# EAGLE schematic PiezoAmpHVDCv3 (EAGLE 6.6.0)
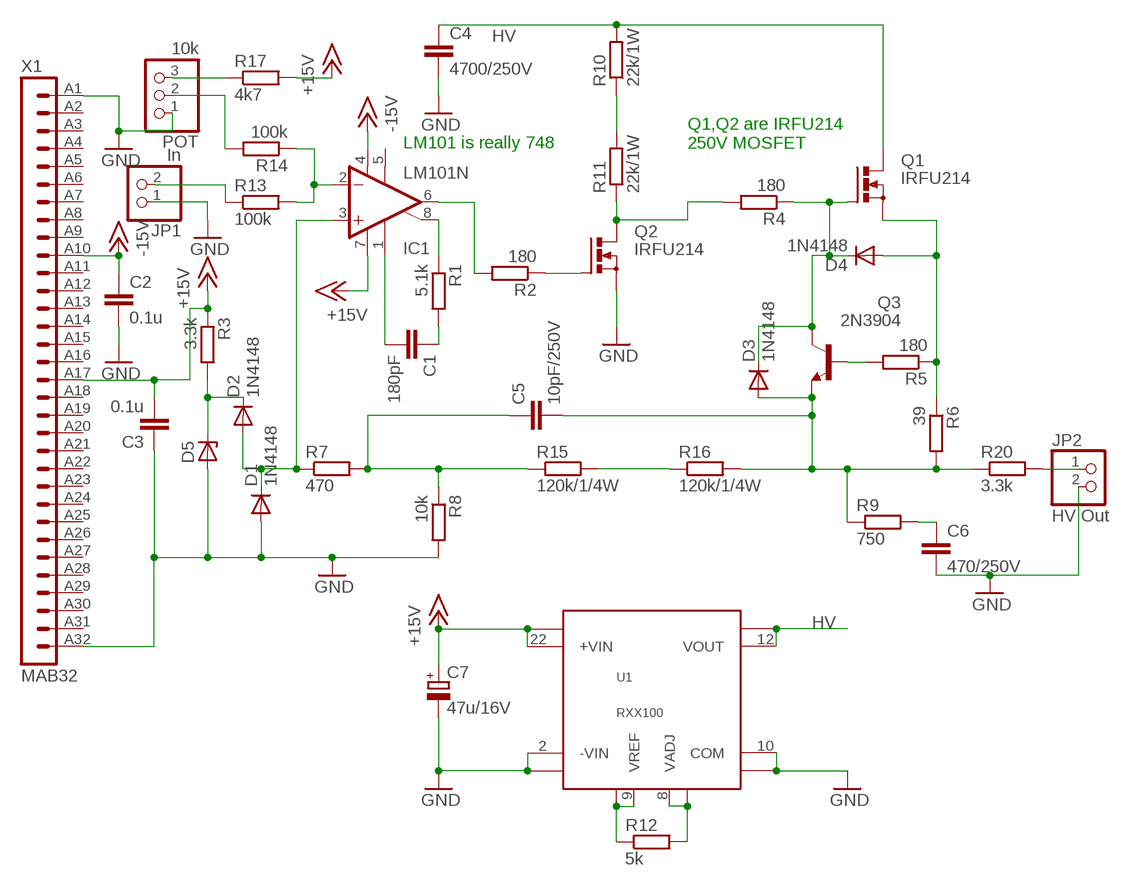
[diagram p0: schematic, sheet 1]

## Parts
C1  180pF  C-EU050-030X075  [C050-030X075]
C2  0.1u  C-EU050-030X075  [C050-030X075]
C3  0.1u  C-EU050-030X075  [C050-030X075]
C4  4700/250V  C-EU075-032X103  [C075-032X103]
C5  10pF/250V  C-EU075-032X103  [C075-032X103]
C6  470/250V  C-EU075-032X103  [C075-032X103]
C7  47u/16V  CPOL-EUSANYO_F8  [SANYO-OSCON_F8]
D1  1N4148  1N4148DO35-7  [DO35-7]
D2  1N4148  1N4148DO35-7  [DO35-7]
D3  1N4148  1N4148DO35-7  [DO35-7]
D4  1N4148  1N4148DO35-7  [DO35-7]
D5  ZENER-DIODEDO34-7  [DO34Z7]
IC1  LM101N  [DIL08]
JP1  In  PINHD-1X2  [1X02]
JP2  HV Out  PINHD-1X2  [1X02]
POT  10k  PINHD-1X3  [1X03]
Q1  IRFU214  IRF512  [TO220BV]
Q2  IRFU214  IRF512  [TO220BV]
Q3  2N3904  [TO92]
R1  5.1k  R-EU_0204/7  [0204/7]
R2  180  R-EU_0204/7  [0204/7]
R3  3.3k  R-EU_0204/7  [0204/7]
R4  180  R-EU_0204/7  [0204/7]
R5  180  R-EU_0204/7  [0204/7]
R6  39  R-EU_0204/7  [0204/7]
R7  470  R-EU_0204/7  [0204/7]
R8  10k  R-EU_0204/7  [0204/7]
R9  750  R-EU_0204/7  [0204/7]
R10  22k/1W  R-EU_0411/15  [0411/15]
R11  22k/1W  R-EU_0411/15  [0411/15]
R12  5k  R-EU_0204/7  [0204/7]
R13  100k  R-EU_0204/5  [0204/5]
R14  100k  R-EU_0204/5  [0204/5]
R15  120k/1/4W  R-EU_0411/15  [0411/15]
R16  120k/1/4W  R-EU_0411/15  [0411/15]
R17  4k7  R-EU_0204/5  [0204/5]
R20  3.3k  R-EU_0204/7  [0204/7]
U1  RXX100  [RXXDIP]
X1  MAB32  [MAB32]

## Nets
+15V: C3.2 C7.+ IC1.7(V+) R3.1 R17.2 U1.22(+VIN) U1.23(VIN2+) X1.A17
-15V: C2.1 IC1.4(V-) X1.A10
GND: C2.2 C3.1 C4.2 C6.2 C7.- D1.A D5.A JP1.1 JP2.2 POT.1 Q2.S R8.2 U1.2(-VIN) U1.3(VIN2-) U1.10(COM) U1.15(COM2) X1.A1 X1.A32
HV: C4.1 Q1.D R10.2 U1.12(VOUT) U1.13(VOUT2)
N$1: JP1.2 R13.1
N$2: R10.1 R11.2
N$3: Q2.G R2.1
N$4: Q2.D R4.2 R11.1
N$5: C6.1 R9.2
N$6: R12.2 U1.8(VADJ) U1.17(VADJ2)
N$7: IC1.8(ON2) R1.1
N$8: IC1.6(OUT) R2.2
N$9: R12.1 U1.9(VREF) U1.16(VREF2)
N$10: IC1.2(-IN) R13.2 R14.1
N$11: D3.C D4.C Q1.G Q3.1(C) R4.1
N$12: D4.A Q1.S R5.1 R6.1
N$13: POT.2 R14.2
N$14: Q3.2(B) R5.2
N$15: C5.2 D3.A Q3.3(E) R6.2 R9.1 R16.2 R20.1
N$17: POT.3 R17.1
N$19: R15.2 R16.1
N$20: C5.1 R7.2 R8.1 R15.1
N$21: D1.C D2.A IC1.3(+IN) R7.1
N$23: D2.C D5.C R3.2
N$25: JP2.1 R20.2
N$26: C1.1 R1.2
N$27: C1.2 IC1.1(ON1)
Unconnected: IC1.5(OPT) X1.A2 X1.A3 X1.A4 X1.A5 X1.A6 X1.A7 X1.A8 X1.A9 X1.A11 X1.A12 X1.A13 X1.A14 X1.A15 X1.A16 X1.A18 X1.A19 X1.A20 X1.A21 X1.A22 X1.A23 X1.A24 X1.A25 X1.A26 X1.A27 X1.A28 X1.A29 X1.A30 X1.A31

## Notes on the sheet
- LM101 is really 748
- Q1,Q2 are IRFU214
  250V MOSFET

## Library data of the parts
C1-C6 = rcl:C-EU: CAPACITOR, European symbol
C7 = rcl:CPOL-EU: POLARIZED CAPACITOR, European symbol
D1-D4 = diode:1N4148: DIODE high speed (Philips)
D5 = diode:ZENER-DIODE: Z-Diode
IC1 = linear:LM101: OP AMP
JP1 JP2 = pinhead:PINHD-1X2: PIN HEADER
POT = pinhead:PINHD-1X3: PIN HEADER
Q1 Q2 = transistor-power:IRF512: N-CHANNEL MOS FET
Q3 = transistor-npn:2N3904: NPN Transistor
R1-R17 R20 = rcl:R-EU_: RESISTOR, European symbol
U1 = custom_parts:RXX100: Innoline Rxx-100_150B DC/DC converters
X1 = con-vg:MAB32: CONNECTOR male, 32 pins, type B, row A, grid 2.54 mm